# EAGLE design FT232R-Breakout (EAGLE 6.5.0)
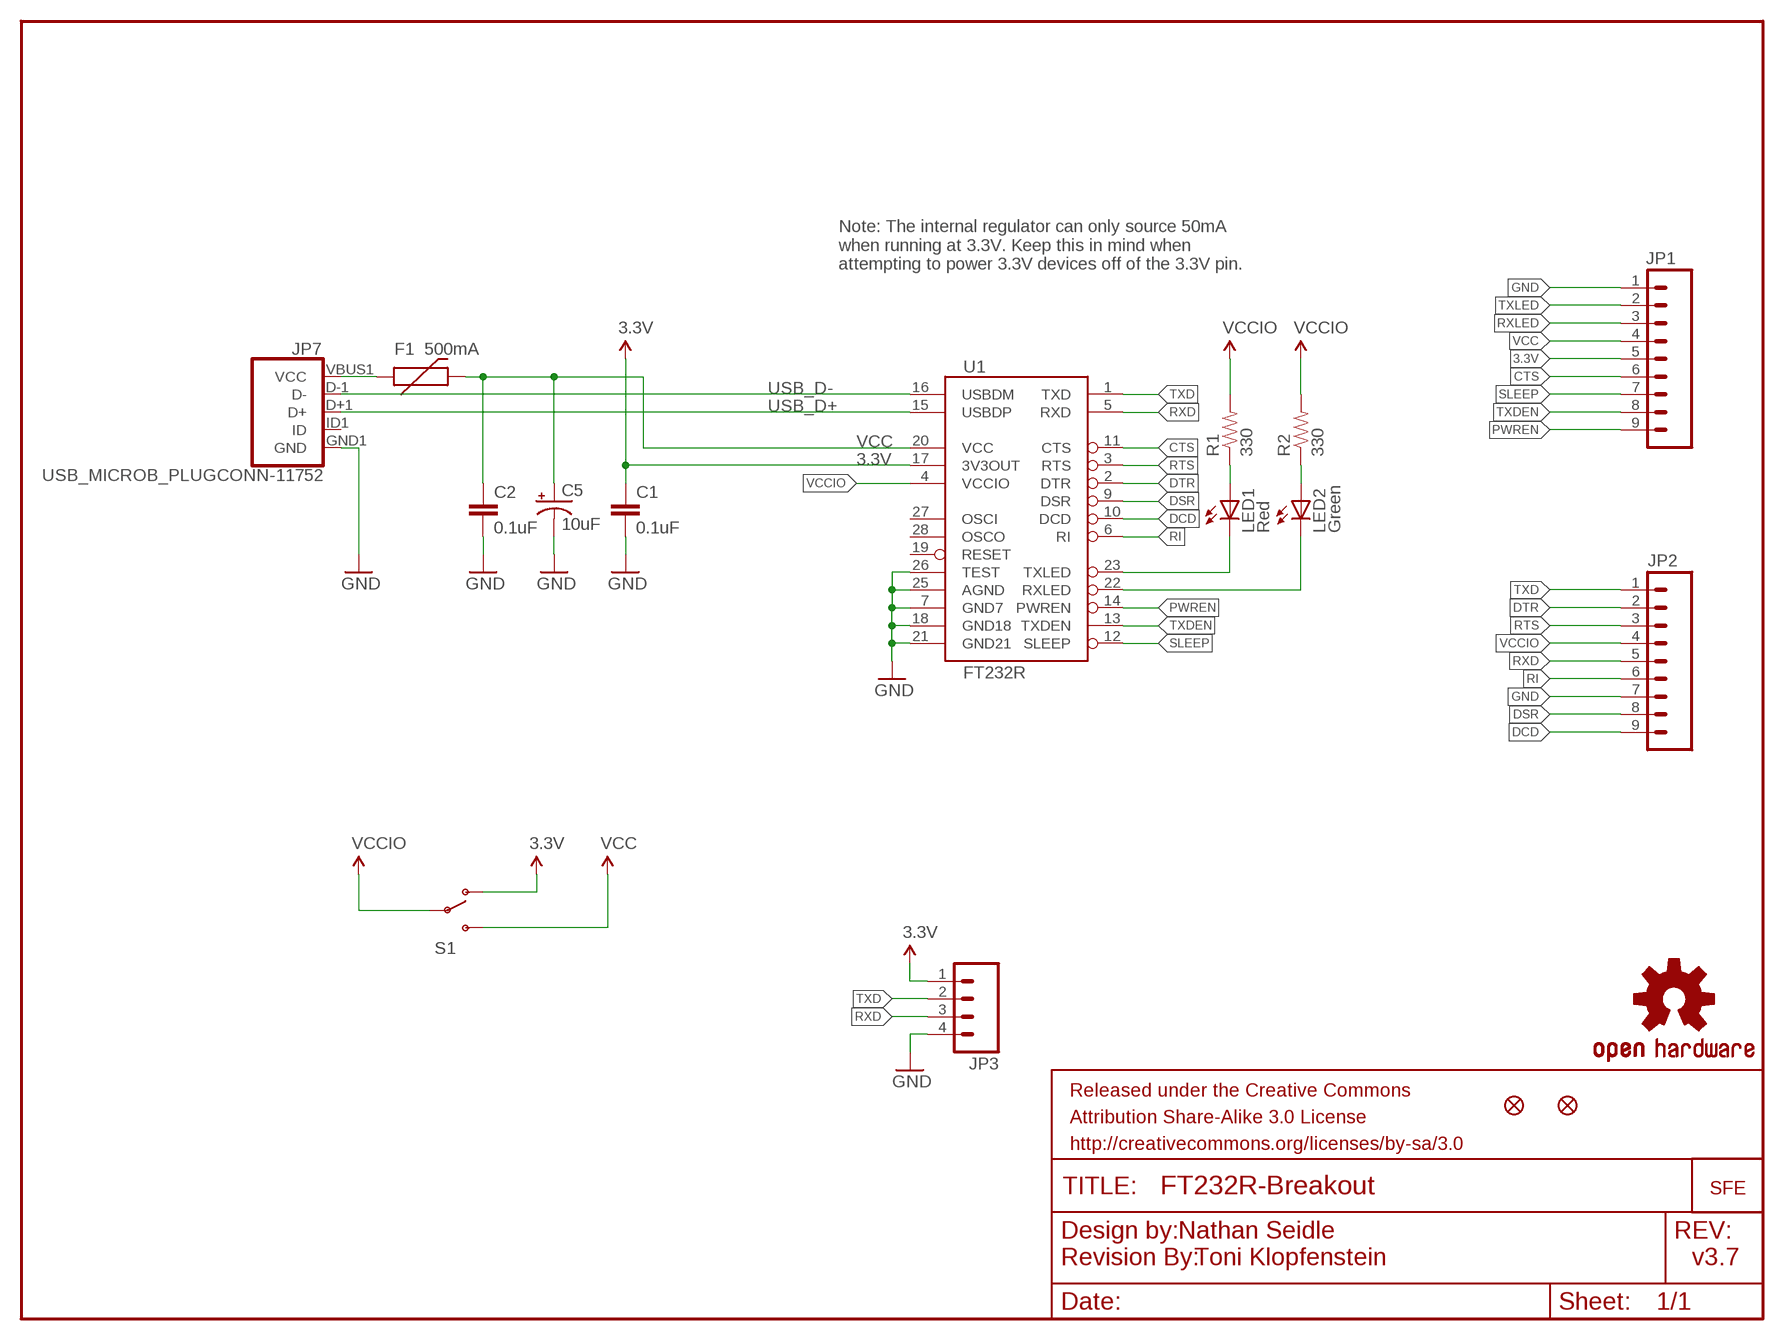
[diagram p0: schematic, sheet 1]

## Parts
C1  0.1uF  0.1UF-25V(+80/-20%)(0603)  [0603-CAP]
C2  0.1uF  0.1UF-25V(+80/-20%)(0603)  [0603-CAP]
C5  10uF  10UF-16V-10%(TANT)  [EIA3216]
F1  500mA  PTCSMD  [PTC-1206]
FRAME1  FRAME-LETTER  [CREATIVE_COMMONS]
JP1  M09  [1X09]
JP2  M09  [1X09]
JP3  M04PTH  [1X04]
JP5  FIDUCIAL1X2  [FIDUCIAL-1X2]
JP6  FIDUCIAL1X2  [FIDUCIAL-1X2]
JP7  USB_MICROB_PLUGCONN-11752  [USB-B-MICRO-SMD_V03]
LED1  Red  LED-RED0603  [LED-0603]
LED2  Green  LED-GREEN0603  [LED-0603]
LOGO1  OSHW-LOGOS  [OSHW-LOGO-S]
R1  330  330OHM1/10W1%(0603)  [0603-RES]
R2  330  330OHM1/10W1%(0603)  [0603-RES]
S1  SWITCH-SPDTSMD  [AYZ0202]
U1  FT232R  FT232RLSSOP  [SSOP28DB]
U$1  REVISION  [REVISION]
U$2  LOGO-SFENEW  [SFE-NEW-WEBLOGO]

## Nets
3.3V [power]: C1.1 JP1.5 JP3.1 S1.1(O) U1.17(3V3OUT)
CTS: JP1.6 U1.11(CTS)
DCD: JP2.9 U1.10(DCD)
DSR: JP2.8 U1.9(DSR)
DTR: JP2.2 U1.2(DTR)
GND [power]: C1.2 C2.2 C5.C(-) JP1.1 JP2.7 JP3.4 JP7.GND1(GND) U1.7(GND7) U1.18(GND18) U1.21(GND21) U1.25(AGND) U1.26(TEST)
N$1: LED1.A R1.1
N$2: LED2.A R2.1
N$3: F1.1 JP7.VBUS1(VCC)
PWREN: JP1.9 U1.14(PWREN)
RI: JP2.6 U1.6(RI)
RTS: JP2.3 U1.3(RTS)
RXD: JP2.5 JP3.3 U1.5(RXD)
RXLED: JP1.3 LED2.C U1.22(RXLED)
SLEEP: JP1.7 U1.12(SLEEP)
TXD: JP2.1 JP3.2 U1.1(TXD)
TXDEN: JP1.8 U1.13(TXDEN)
TXLED: JP1.2 LED1.C U1.23(TXLED)
USB_D+: JP7.D+1(D+) U1.15(USBDP)
USB_D-: JP7.D-1(D-) U1.16(USBDM)
VCC [power]: C2.1 C5.A(+) F1.2 JP1.4 S1.3(S) U1.20(VCC)
VCCIO: JP2.4 R1.2 R2.2 S1.2(P) U1.4(VCCIO)
Unconnected: JP7.ID1(ID) U1.19(RESET) U1.27(OSCI) U1.28(OSCO)

## Notes on the sheet
- Note: The internal regulator can only source 50mA
  when running at 3.3V. Keep this in mind when
  attempting to power 3.3V devices off of the 3.3V pin.
- Nathan Seidle
- Toni Klopfenstein | v3.7

## Library data of the parts
C1 C2 = SparkFun-Capacitors:0.1UF-25V(+80/-20%)(0603): CAP-00810 Ceramic Standard decoupling cap; PROD_ID: CAP-00810
C5 = SparkFun-Capacitors:10UF-16V-10%(TANT): CAP-00811 1206/EIA-3216 Tantalum capacitor; PROD_ID: CAP-00811
F1 = SparkFun:PTC: Resettable Fuse PTC Resettable Fuse. Spark Fun Electronics SKU : COM-08357
FRAME1 = SparkFun-Aesthetics:FRAME-LETTER: Schematic Frame Standard 8.5x11 US Letter frame
JP1 JP2 = SparkFun:M09: Header 9 Standard 9-pin 0.1" header. Use with straight break away headers (SKU : PRT-00116), right angle break away headers (PRT-00553), swiss pins (PRT-00743), machine pins (PRT-00117), and female headers (PRT-00115).
JP3 = SparkFun:M04: Header 4 Standard 4-pin 0.1" header. Use with straight break away headers (SKU : PRT-00116), right angle break away headers (PRT-00553), swiss pins (PRT-00743), machine pins (PRT-00117), and female headers (PRT-00115). Molex polarized connector foot print use with SKU : PRT-08231 with associated crimp pins and housings.
JP5 JP6 = SparkFun:FIDUCIAL: Fiducial Alignment Points Various fiducial points for machine vision alignment.
JP7 = SparkFun-Connectors:USB_MICROB_PLUG: USB Micro-B Plug Comes in a variety of packages. Check out Hirose's ZX-x0 line: http://www.hirose.co.jp/cataloge_hp/e24200011.pdf; PROD_ID: CONN-11752
LED1 = SparkFun-LED:LED-RED: Assorted Red LEDs LilyPad 1206- DIO-09912 1206- DIO-00809 0603- DIO-00819; PROD_ID: DIO-00819; VALUE: RED
LED2 = SparkFun-LED:LED-GREEN: Various green LEDs 0603- DIO-00821 LARGE- DIO-00862 LILYPAD- DIO-09910; PROD_ID: DIO-00821; VALUE: GREEN
LOGO1 = SparkFun-Aesthetics:OSHW-LOGO: Open Source Hardware Logo This logo indicates the piece of hardware it is found on incorporates a OSHW license and/or adheres to the definition of open source hardware found here: http://freedomdefined.org/OSHW
R1 R2 = SparkFun-Resistors:330OHM1/10W1%(0603): RES-00818; PROD_ID: RES-00818
S1 = SparkFun-Electromechanical:SWITCH-SPDT: SPDT Switch Simple slide switch, Spark Fun Electronics SKU : COM-00102 DPDT SMT slide switch, AYZ0202, SWCH-08179; PROD_ID: SWCH-08179
U1 = SparkFun:FT232RL: USB UART FT232RL 4th Generation USB UART (USB <-> Serial) Controller. Spark Fun Electronics SKU : COM-00650
U$1 = SparkFun-Aesthetics:REVISION
U$2 = SparkFun:LOGO-SFE: Spark Fun Electronics PCB Logo This is the standard Spark Fun Electronics PCB logo.

## Net classes
0 default: width 0.203 mm
1 power: width 0.254 mm

## Board
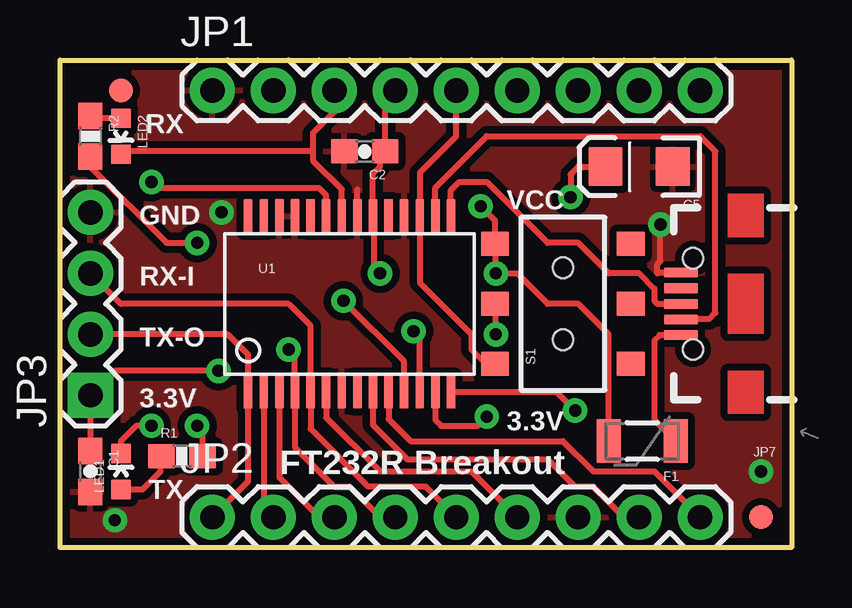
[diagram p1: board, top side]
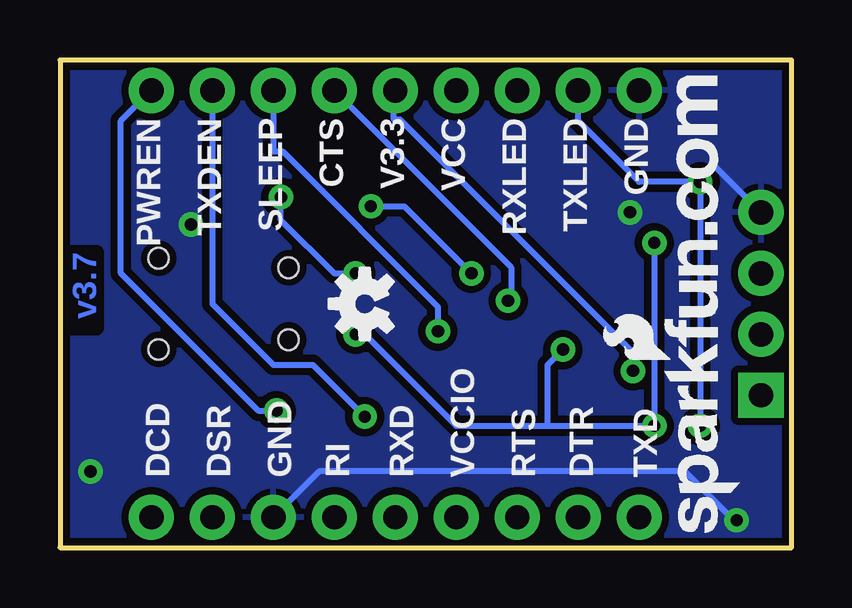
[diagram p2: board, bottom side, seen from below]

Size 30.48 x 20.32 mm. Coordinates in mm from the lower left corner, seen from the top.
Outline: 0,20.32 30.48,20.32 30.48,0 0,0 0,20.32
Copper layers (1*16): Top 0.035mm / dielectric 1.5mm / Bottom 0.035mm
Design rules "SparkFun *": minimum track width 8mil, minimum drill 20mil, track to track 8mil, track to pad 8mil, pad to pad 8mil, via to via 8mil, smd to smd 8mil, copper to edge 10mil, drill to drill 8mil, minimum pad ring 12mil, minimum via ring 10mil, stop-mask expansion 4mil, vias tented up to drill 20mil, thermal gap 10mil

### Footprints (pad centres in the part's own frame; a part is rotated, then mirrored left to right if it is on the bottom)
0603-CAP = smd 1.1 x 1: 1 -0.85,0; 2 0.85,0
EIA3216 = smd 1.4 x 1.6: A 1.4,0; C -1.4,0
PTC-1206 = smd 1 x 1.8: 1 -1.4,0; 2 1.4,0
1X09 = drill 1.016 pad 1.88: 1 0,0; 2 2.54,0; 3 5.08,0; 4 7.62,0; 5 10.16,0; 6 12.7,0; 7 15.24,0; 8 17.78,0; 9 20.32,0
1X04 = drill 1.016 pad 1.88 square: 1 0,0 | drill 1.016 pad 1.88: 2 2.54,0; 3 5.08,0; 4 7.62,0
FIDUCIAL-1X2 = smd 1 x 1: 1 0,0
USB-B-MICRO-SMD_V03 = smd 1.4 x 0.4: D+1 2.7,0; D-1 2.7,0.65; GND1 2.7,-1.3; ID1 2.7,-0.65; VBUS1 2.7,1.3 | hole 0.85: 2.2,1.9; 2.2,-1.9
LED-0603 = smd 0.8 x 0.8: A 0,-0.75; C 0,0.75
0603-RES = smd 1.1 x 1: 1 -0.85,0; 2 0.85,0
AYZ0202 = smd 1 x 1.15: 1 -2.5,2.825; 2 0,2.825; 3 2.5,2.825; 4 -2.5,-2.825; 5 0,-2.825; 6 2.5,-2.825 | hole 0.85: 1.5,0; -1.5,0
SSOP28DB = smd 0.348 x 1.397: 1 -4.225,-3.656; 2 -3.575,-3.656; 3 -2.925,-3.656; 4 -2.275,-3.656; 5 -1.625,-3.656; 6 -0.975,-3.656; 7 -0.325,-3.656; 8 0.325,-3.656; 9 0.975,-3.656; 10 1.625,-3.656; 11 2.275,-3.656; 12 2.925,-3.656; 13 3.575,-3.656; 14 4.225,-3.656; 15 4.225,3.656; 16 3.575,3.656; 17 2.925,3.656; 18 2.275,3.656; 19 1.625,3.656; 20 0.975,3.656; 21 0.325,3.656; 22 -0.325,3.656; 23 -0.975,3.656; 24 -1.625,3.656; 25 -2.275,3.656; 26 -2.925,3.656; 27 -3.575,3.656; 28 -4.225,3.656

### Placement (x,y rotation side)
C1  1.27,3.18 270 top
C2  12.7,16.51 180 top
C5  24.13,15.88 180 top
F1  24.26,4.45 180 top
FRAME1  1.66,-10.16 0 top  (outside the outline)
JP1  6.35,19.05 0 top
JP2  6.35,1.27 0 top
JP3  1.27,6.35 90 top
JP5  29.21,1.27 0 top
JP6  2.54,19.05 0 top
JP7  28.57,10.16 180 top
LED1  2.54,3.18 0 top
LED2  2.54,17.14 180 top
LOGO1  17.78,10.16 90 bottom
R1  5.08,3.81 0 top
R2  1.27,17.14 270 top
S1  20.96,10.16 90 top
U1  12.07,10.16 0 top
U$1  12.7,-12.7 0 top  (outside the outline)
U$2  2.16,0.64 90 bottom

### Tracks (layer width: path | path; a pad name or v marks a point on that pad's centre or on a via)
3.3V  (via drill 0.51)
  Top 0.254: 1.4,6.48 JP3.1 | JP1.5 16.51,17.14 14.99,15.62 U1.17 14.99,11.04 17.14,8.89 17.14,8.26 17.78,7.62 18.09,7.62 S1.1 | JP3.1 C1.1 | v6.6,7.37 2.29,7.37 JP3.1
  Bottom 0.254: JP1.5 16.57,18.99 16.57,17.84 16.32,17.84 6.6,8.13 v6.6,7.37
CTS  (via drill 0.51)
  Top 0.254: U1.11 14.34,7.76 v11.81,10.29
  Bottom 0.254: JP1.6 11.68,11.68 11.68,10.41 v11.81,10.29
DCD
  Top 0.254: JP2.9 24.77,3.18 22.23,3.18 20.96,4.45 14.61,4.45 13.69,5.36 U1.10
DSR
  Top 0.254: JP2.8 23.5,1.27 22.23,2.54 21.46,2.54 20.32,3.68 14.48,3.68 13.04,5.12 U1.9
DTR
  Top 0.254: U1.2 8.49,1.67 JP2.2
GND  (via drill 0.51)
  Top 0.254: U1.21 12.39,14.93 | v25.02,13.46 25.02,11.94 24.89,11.81 24.89,11.43 24.92,11.46 JP7.GND1
  Bottom 0.254: JP3.4 1.9,13.97 1.9,14.61 3.18,15.88 | JP2.7 19.68,3.18 4.45,3.18 2.41,1.14 v2.29,1.14
  other vias: 29.21,3.18 6.73,13.97
  pour Bottom (isolate 0.305): 0,0 0,20.32 30.48,20.32 30.48,0
  pour Top (isolate 0.305): 0,0 0,20.32 30.48,20.32 30.48,0
N$1
  Top 0.254: LED1.A 3.44,2.42 4.19,3.18 4.19,3.77 R1.1
N$2
  Top 0.254: 2.64,17.89 LED2.A 1.37,17.89 R2.1
N$3
  Top 0.254: F1.1 24.77,5.34 24.77,8.64 24.99,8.86 JP7.VBUS1
PWREN  (via drill 0.51)
  Top 0.254: U1.14 20.67,6.5 v21.46,5.71
  Bottom 0.254: JP1.9 27.94,17.78 27.94,11.43 22.23,5.71 v21.46,5.71
RI
  Top 0.254: 19.05,1.4 JP2.6 17.14,3.18 13.34,3.18 11.09,5.42 U1.6
RTS
  Top 0.254: U1.3 9.14,2.93 10.79,1.27 JP2.3
RXD
  Top 0.254: JP3.3 2.54,10.16 9.53,10.16 10.44,9.25 U1.5 10.44,4.95 12.85,2.54 15.24,2.54 JP2.5
RXLED
  Top 0.254: U1.22 11.74,14.93 10.54,16.13 10.54,16.51 | 10.54,16.51 2.65,16.51 LED2.C | JP1.3 11.43,18.16 10.54,17.27 10.54,16.51
SLEEP  (via drill 0.51)
  Top 0.254: U1.12 14.99,8.76 v14.73,9.02
  Bottom 0.254: JP1.7 21.59,16.51 21.21,16.51 14.73,10.03 v14.73,9.02
TXD
  Top 0.254: JP2.1 7.84,2.76 U1.1 7.84,8.04 6.99,8.89 JP3.2
TXDEN  (via drill 0.51)
  Top 0.254: U1.13 15.64,5.31 15.88,5.08 17.4,5.08 v17.78,5.46
  Bottom 0.254: JP1.8 24.13,10.16 21.59,7.62 19.94,7.62 v17.78,5.46
TXLED  (via drill 0.51)
  Top 0.254: v3.81,5.08 3.18,5.08 2.54,4.45 LED1.C | U1.23 11.09,14.69 10.79,14.99 4.06,14.99 v3.81,15.24
  Bottom 0.254: v3.81,5.08 v3.81,15.24 6.35,15.24 8.89,17.78 JP1.2
USB_D+
  Top 0.254: U1.15 16.29,14.89 16.64,15.24 17.78,15.24 20.32,12.7 21.59,12.7 22.86,11.43 24.13,11.43 24.77,10.79 24.77,10.29 24.89,10.16 JP7.D+1
USB_D-
  Top 0.254: U1.16 15.64,15 17.78,17.14 26.67,17.14 27.3,16.51 27.3,9.78 27.05,9.53 25.89,9.53 JP7.D-1
VCC  (via drill 0.51)
  Top 0.254: F1.2 22.86,8.89 21.59,10.16 20.32,10.16 19.05,11.43 v18.16,11.43 18.16,12.63 S1.3 18.13,13.62 v17.53,14.22 | JP1.4 13.55,18.63 C2.1 13.34,16.3 13.34,15.88 13.04,15.58 U1.20 13.08,13.78 13.08,11.68 v13.34,11.43 | C5.A 21.59,15.88 21.27,15.56 v21.27,14.61
  Bottom 0.254: v18.16,11.43 19.05,11.43 21.27,13.65 v21.27,14.61 | v13.34,11.43 16.13,14.22 v17.53,14.22
VCCIO  (via drill 0.51)
  Top 0.254: v9.53,8.26 9.79,7.99 U1.4 9.79,4.18 11.43,2.54 12.07,2.54 13.34,1.27 JP2.4 | v5.71,5.08 5.93,5.08 R1.2 | R2.2 1.27,15.88 4.45,12.7 v5.71,12.7 | S1.2 18.13,8.92 v18.16,8.89
  Bottom 0.254: v5.71,12.7 v5.71,5.08 10.16,5.08 | 10.16,5.08 10.16,7.62 v9.53,8.26 | 10.16,5.08 13.97,5.08 17.78,8.89 v18.16,8.89

### Text on the board
Bottom: v3.7
tPlace: RX | GND | VCC | RX-I | TX-O | 3.3V | 3.3V | FT232R Breakout | TX
bPlace: GND | TXLED | RXLED | VCC | V3.3 | CTS | SLEEP | TXDEN | PWREN | TXD | DTR | RTS | VCCIO | RXD | RI | GND | DSR | DCD
tDocu: Nathan Seidle | Toni Klopfenstein